# Altium schematic sheet 01.SchDoc
size 420 x 297 mm
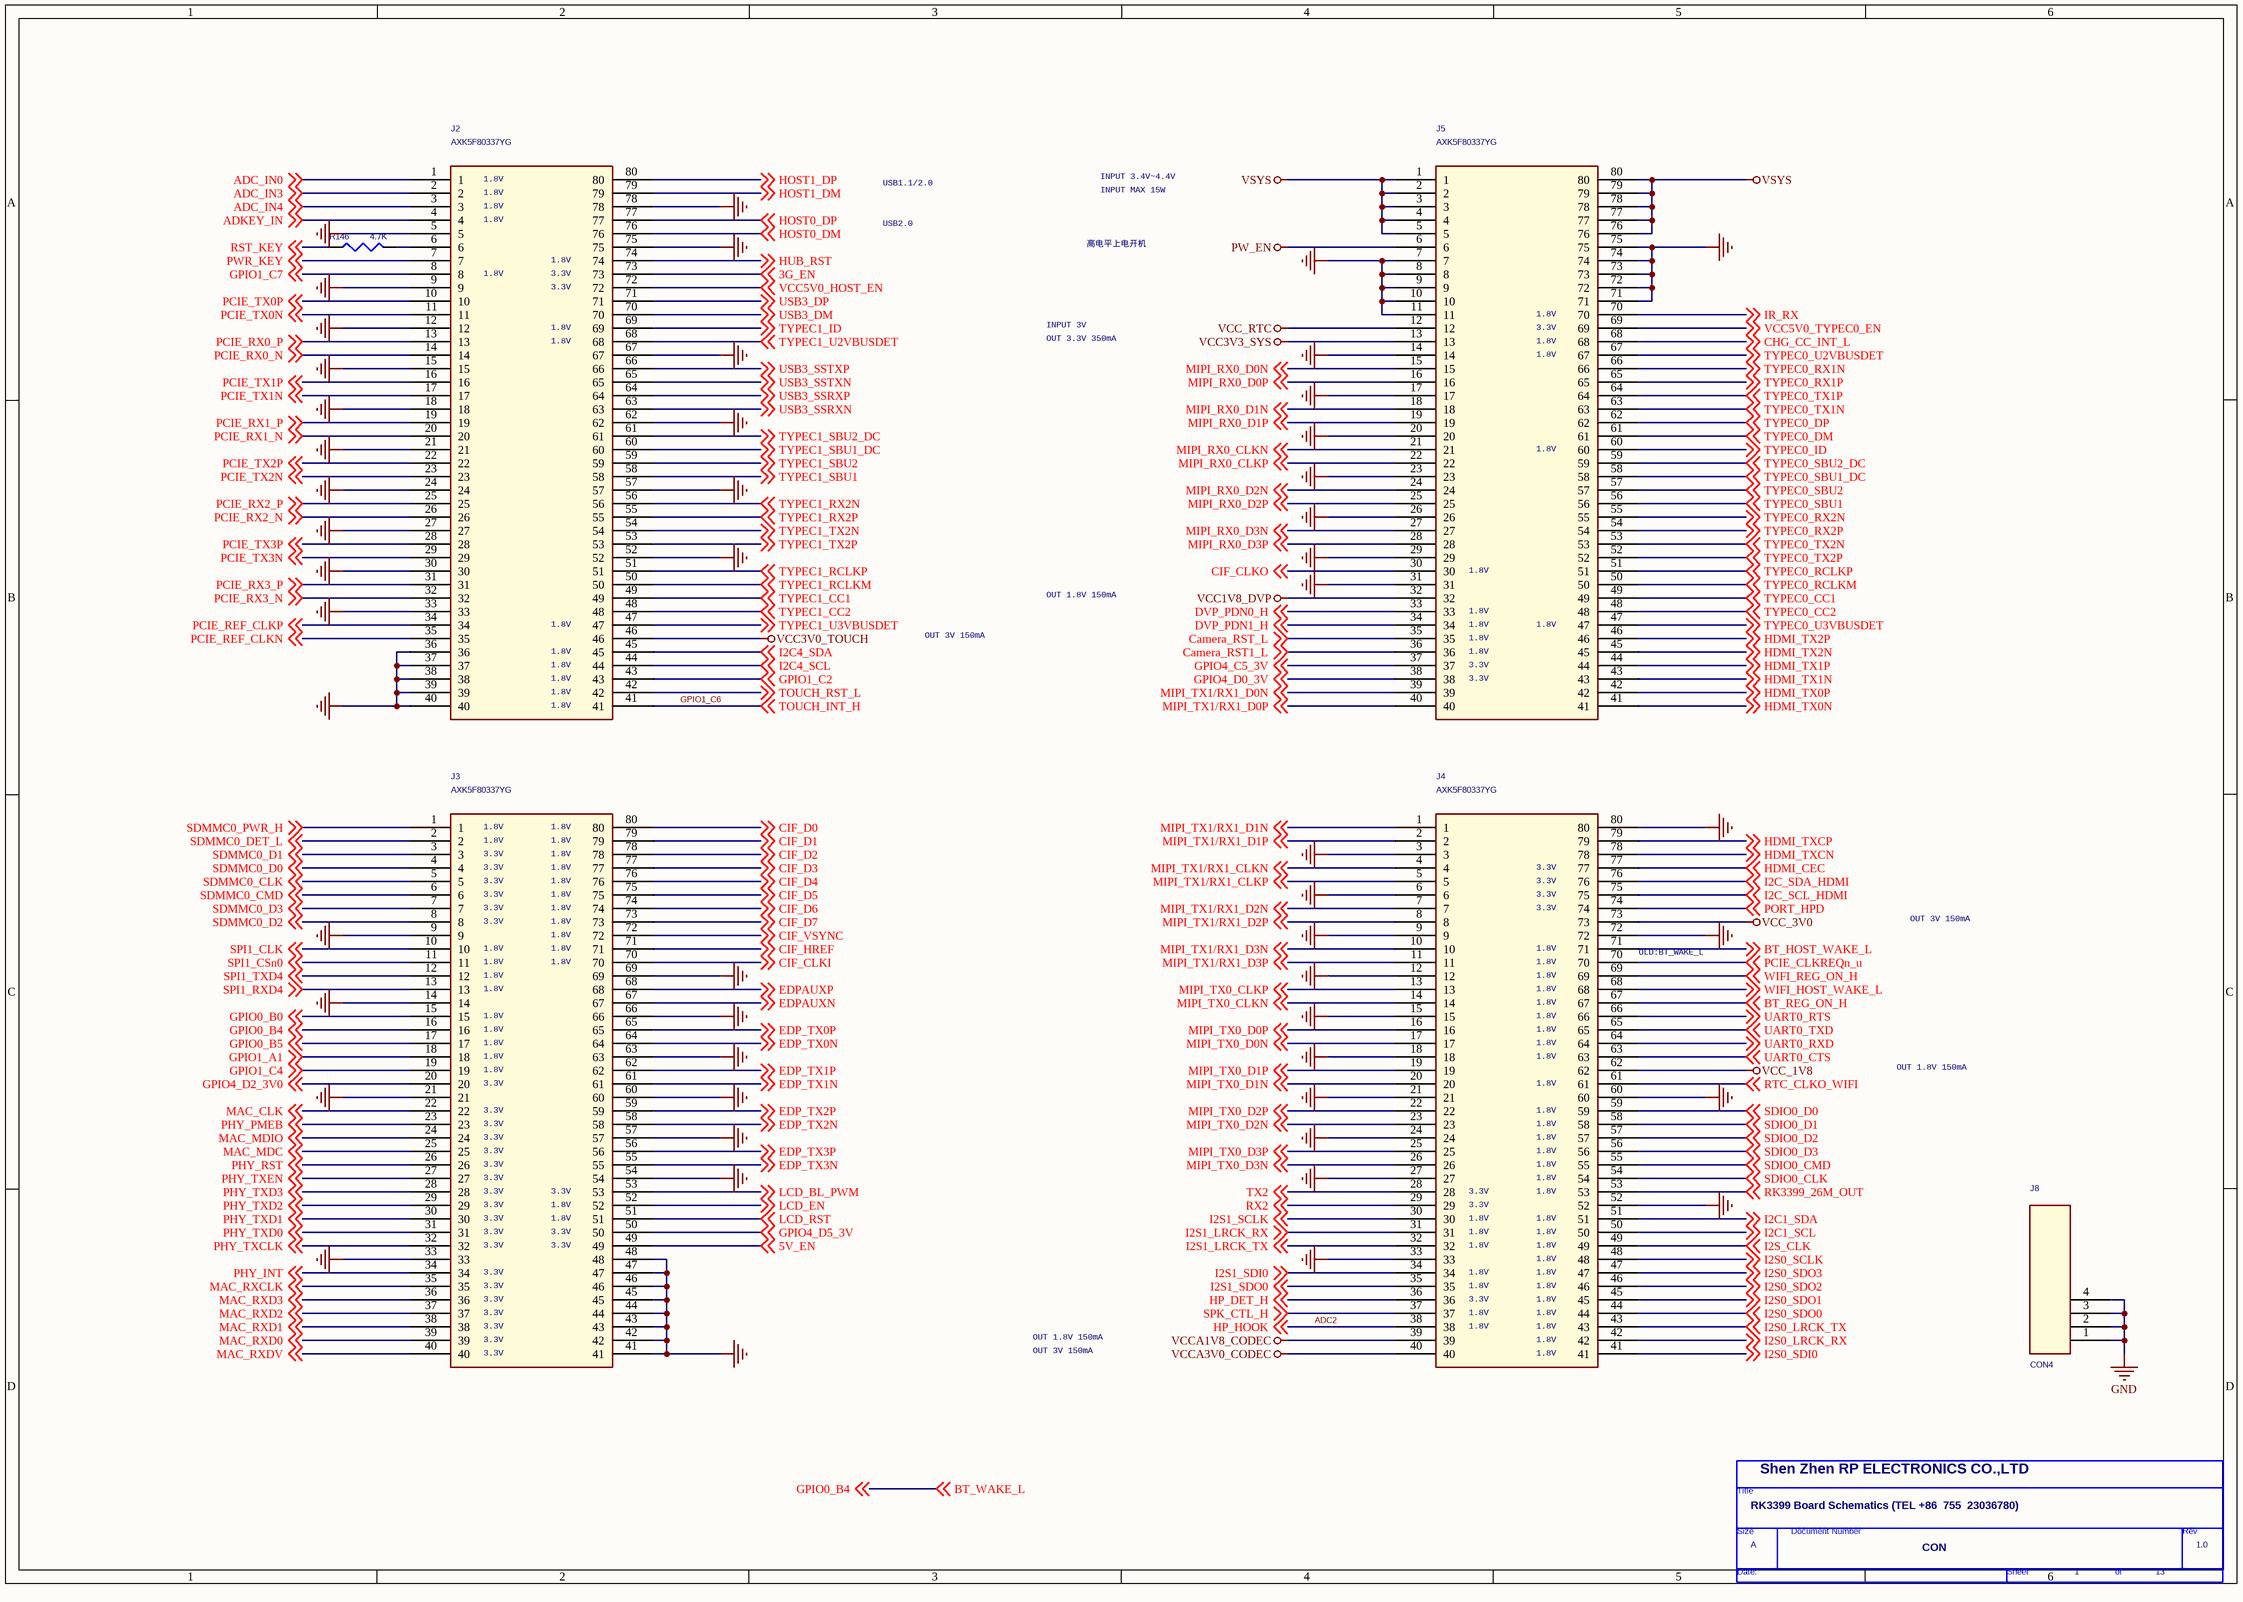
[diagram p0: 01.SchDoc]

## Parts
*  Doc: CON  RevCode: 1.0  Title: RK3399 Board Schematics (TEL +86  755  23036780)  Page Size: A  Page Number: 1  Page Count: 13  Cage Code: Shen Zhen RP ELECTRONICS CO.,LTD  (hidden comment: TitleBlock0)  (graphical)
J2  AXK5F80337YG  [AXK5F80337YG]
J3  AXK5F80337YG  [AXK5F80337YG]
J4  AXK5F80337YG  [AXK5F80337YG]
J5  AXK5F80337YG  [AXK5F80337YG]
J8  CON4  [DIP-CORE]
R146  4.7K  [0805]

## Nets
GND: J2.5 J2.9 J2.12 J2.15 J2.18 J2.21 J2.24 J2.27 J2.30 J2.33 J2.36 J2.37 J2.38 J2.39 J2.40 J2.52 J2.57 J2.62 J2.67 J2.75 J2.78 J3.9 J3.14 J3.21 J3.33 J3.41 J3.42 J3.43 J3.44 J3.45 J3.46 J3.47 J3.48 J3.54 J3.57 J3.60 J3.63 J3.66 J3.69 J4.3 J4.6 J4.9 J4.12 J4.15 J4.18 J4.21 J4.24 J4.27 J4.33 J4.52 J4.60 J4.72 J4.80 J5.7 J5.8 J5.9 J5.10 J5.11 J5.14 J5.17 J5.20 J5.23 J5.26 J5.29 J5.31 J5.71 J5.72 J5.73 J5.74 J5.75 J8.1 J8.2 J8.3 J8.4
PW_EN: J5.6
VCC1V8_DVP: J5.32
VCC3V0_TOUCH: J2.46
VCC3V3_SYS: J5.13
VCC_1V8: J4.62
VCC_3V0: J4.73
VCC_RTC: J5.12
VCCA1V8_CODEC: J4.39
VCCA3V0_CODEC: J4.40
VSYS: J5.1 J5.2 J5.3 J5.4 J5.5 J5.76 J5.77 J5.78 J5.79 J5.80
3G_EN: J2.73 ; off-sheet 3G_EN
5V_EN: J3.49 ; off-sheet 5V_EN
ADC2: J4.38 ; off-sheet HP_HOOK  [also labelled HP_HOOK]
ADC_IN0: J2.1 ; off-sheet ADC_IN0
ADC_IN3: J2.2 ; off-sheet ADC_IN3
ADC_IN4: J2.3 ; off-sheet ADC_IN4
ADKEY_IN: J2.4 ; off-sheet ADKEY_IN
BT_HOST_WAKE_L: J4.71 ; off-sheet BT_HOST_WAKE_L
BT_REG_ON_H: J4.67 ; off-sheet BT_REG_ON_H
BT_WAKE_L: J3.16 ; off-sheet GPIO0_B4, off-sheet BT_WAKE_L  [also labelled GPIO0_B4]
Camera_RST1_L: J5.36 ; off-sheet Camera_RST1_L
Camera_RST_L: J5.35 ; off-sheet Camera_RST_L
CHG_CC_INT_L: J5.68 ; off-sheet CHG_CC_INT_L
CIF_CLKI: J3.70 ; off-sheet CIF_CLKI
CIF_CLKO: J5.30 ; off-sheet CIF_CLKO
CIF_D0: J3.80 ; off-sheet CIF_D0
CIF_D1: J3.79 ; off-sheet CIF_D1
CIF_D2: J3.78 ; off-sheet CIF_D2
CIF_D3: J3.77 ; off-sheet CIF_D3
CIF_D4: J3.76 ; off-sheet CIF_D4
CIF_D5: J3.75 ; off-sheet CIF_D5
CIF_D6: J3.74 ; off-sheet CIF_D6
CIF_D7: J3.73 ; off-sheet CIF_D7
CIF_HREF: J3.71 ; off-sheet CIF_HREF
CIF_VSYNC: J3.72 ; off-sheet CIF_VSYNC
DVP_PDN0_H: J5.33 ; off-sheet DVP_PDN0_H
DVP_PDN1_H: J5.34 ; off-sheet DVP_PDN1_H
EDP_TX0N: J3.64 ; off-sheet EDP_TX0N
EDP_TX0P: J3.65 ; off-sheet EDP_TX0P
EDP_TX1N: J3.61 ; off-sheet EDP_TX1N
EDP_TX1P: J3.62 ; off-sheet EDP_TX1P
EDP_TX2N: J3.58 ; off-sheet EDP_TX2N
EDP_TX2P: J3.59 ; off-sheet EDP_TX2P
EDP_TX3N: J3.55 ; off-sheet EDP_TX3N
EDP_TX3P: J3.56 ; off-sheet EDP_TX3P
EDPAUXN: J3.67 ; off-sheet EDPAUXN
EDPAUXP: J3.68 ; off-sheet EDPAUXP
GPIO0_B0: J3.15 ; off-sheet GPIO0_B0
GPIO0_B5: J3.17 ; off-sheet GPIO0_B5
GPIO1_A1: J3.18 ; off-sheet GPIO1_A1
GPIO1_C2: J2.43 ; off-sheet GPIO1_C2
GPIO1_C4: J3.19 ; off-sheet GPIO1_C4
GPIO1_C6: J2.41 ; off-sheet TOUCH_INT_H  [also labelled TOUCH_INT_H]
GPIO1_C7: J2.8 ; off-sheet GPIO1_C7
GPIO4_C5_3V: J5.37 ; off-sheet GPIO4_C5_3V
GPIO4_D0_3V: J5.38 ; off-sheet GPIO4_D0_3V
GPIO4_D2_3V0: J3.20 ; off-sheet GPIO4_D2_3V0
GPIO4_D5_3V: J3.50 ; off-sheet GPIO4_D5_3V
HDMI_CEC: J4.77 ; off-sheet HDMI_CEC
HDMI_TX0N: J5.41 ; off-sheet HDMI_TX0N
HDMI_TX0P: J5.42 ; off-sheet HDMI_TX0P
HDMI_TX1N: J5.43 ; off-sheet HDMI_TX1N
HDMI_TX1P: J5.44 ; off-sheet HDMI_TX1P
HDMI_TX2N: J5.45 ; off-sheet HDMI_TX2N
HDMI_TX2P: J5.46 ; off-sheet HDMI_TX2P
HDMI_TXCN: J4.78 ; off-sheet HDMI_TXCN
HDMI_TXCP: J4.79 ; off-sheet HDMI_TXCP
HOST0_DM: J2.76 ; off-sheet HOST0_DM
HOST0_DP: J2.77 ; off-sheet HOST0_DP
HOST1_DM: J2.79 ; off-sheet HOST1_DM
HOST1_DP: J2.80 ; off-sheet HOST1_DP
HP_DET_H: J4.36 ; off-sheet HP_DET_H
HUB_RST: J2.74 ; off-sheet HUB_RST
I2C1_SCL: J4.50 ; off-sheet I2C1_SCL
I2C1_SDA: J4.51 ; off-sheet I2C1_SDA
I2C4_SCL: J2.44 ; off-sheet I2C4_SCL
I2C4_SDA: J2.45 ; off-sheet I2C4_SDA
I2C_SCL_HDMI: J4.75 ; off-sheet I2C_SCL_HDMI
I2C_SDA_HDMI: J4.76 ; off-sheet I2C_SDA_HDMI
I2S0_LRCK_RX: J4.42 ; off-sheet I2S0_LRCK_RX
I2S0_LRCK_TX: J4.43 ; off-sheet I2S0_LRCK_TX
I2S0_SCLK: J4.48 ; off-sheet I2S0_SCLK
I2S0_SDI0: J4.41 ; off-sheet I2S0_SDI0
I2S0_SDO0: J4.44 ; off-sheet I2S0_SDO0
I2S0_SDO1: J4.45 ; off-sheet I2S0_SDO1
I2S0_SDO2: J4.46 ; off-sheet I2S0_SDO2
I2S0_SDO3: J4.47 ; off-sheet I2S0_SDO3
I2S1_LRCK_RX: J4.31 ; off-sheet I2S1_LRCK_RX
I2S1_LRCK_TX: J4.32 ; off-sheet I2S1_LRCK_TX
I2S1_SCLK: J4.30 ; off-sheet I2S1_SCLK
I2S1_SDI0: J4.34 ; off-sheet I2S1_SDI0
I2S1_SDO0: J4.35 ; off-sheet I2S1_SDO0
I2S_CLK: J4.49 ; off-sheet I2S_CLK
IR_RX: J5.70 ; off-sheet IR_RX
LCD_BL_PWM: J3.53 ; off-sheet LCD_BL_PWM
LCD_EN: J3.52 ; off-sheet LCD_EN
LCD_RST: J3.51 ; off-sheet LCD_RST
MAC_CLK: J3.22 ; off-sheet MAC_CLK
MAC_MDC: J3.25 ; off-sheet MAC_MDC
MAC_MDIO: J3.24 ; off-sheet MAC_MDIO
MAC_RXCLK: J3.35 ; off-sheet MAC_RXCLK
MAC_RXD0: J3.39 ; off-sheet MAC_RXD0
MAC_RXD1: J3.38 ; off-sheet MAC_RXD1
MAC_RXD2: J3.37 ; off-sheet MAC_RXD2
MAC_RXD3: J3.36 ; off-sheet MAC_RXD3
MAC_RXDV: J3.40 ; off-sheet MAC_RXDV
MIPI_RX0_CLKN: J5.21 ; off-sheet MIPI_RX0_CLKN
MIPI_RX0_CLKP: J5.22 ; off-sheet MIPI_RX0_CLKP
MIPI_RX0_D0N: J5.15 ; off-sheet MIPI_RX0_D0N
MIPI_RX0_D0P: J5.16 ; off-sheet MIPI_RX0_D0P
MIPI_RX0_D1N: J5.18 ; off-sheet MIPI_RX0_D1N
MIPI_RX0_D1P: J5.19 ; off-sheet MIPI_RX0_D1P
MIPI_RX0_D2N: J5.24 ; off-sheet MIPI_RX0_D2N
MIPI_RX0_D2P: J5.25 ; off-sheet MIPI_RX0_D2P
MIPI_RX0_D3N: J5.27 ; off-sheet MIPI_RX0_D3N
MIPI_RX0_D3P: J5.28 ; off-sheet MIPI_RX0_D3P
MIPI_TX0_CLKN: J4.14 ; off-sheet MIPI_TX0_CLKN
MIPI_TX0_CLKP: J4.13 ; off-sheet MIPI_TX0_CLKP
MIPI_TX0_D0N: J4.17 ; off-sheet MIPI_TX0_D0N
MIPI_TX0_D0P: J4.16 ; off-sheet MIPI_TX0_D0P
MIPI_TX0_D1N: J4.20 ; off-sheet MIPI_TX0_D1N
MIPI_TX0_D1P: J4.19 ; off-sheet MIPI_TX0_D1P
MIPI_TX0_D2N: J4.23 ; off-sheet MIPI_TX0_D2N
MIPI_TX0_D2P: J4.22 ; off-sheet MIPI_TX0_D2P
MIPI_TX0_D3N: J4.26 ; off-sheet MIPI_TX0_D3N
MIPI_TX0_D3P: J4.25 ; off-sheet MIPI_TX0_D3P
MIPI_TX1/RX1_CLKN: J4.4 ; off-sheet MIPI_TX1/RX1_CLKN
MIPI_TX1/RX1_CLKP: J4.5 ; off-sheet MIPI_TX1/RX1_CLKP
MIPI_TX1/RX1_D0N: J5.39 ; off-sheet MIPI_TX1/RX1_D0N
MIPI_TX1/RX1_D0P: J5.40 ; off-sheet MIPI_TX1/RX1_D0P
MIPI_TX1/RX1_D1N: J4.1 ; off-sheet MIPI_TX1/RX1_D1N
MIPI_TX1/RX1_D1P: J4.2 ; off-sheet MIPI_TX1/RX1_D1P
MIPI_TX1/RX1_D2N: J4.7 ; off-sheet MIPI_TX1/RX1_D2N
MIPI_TX1/RX1_D2P: J4.8 ; off-sheet MIPI_TX1/RX1_D2P
MIPI_TX1/RX1_D3N: J4.10 ; off-sheet MIPI_TX1/RX1_D3N
MIPI_TX1/RX1_D3P: J4.11 ; off-sheet MIPI_TX1/RX1_D3P
PCIE_CLKREQn_u: J4.70 ; off-sheet PCIE_CLKREQn_u
PCIE_REF_CLKN: J2.35 ; off-sheet PCIE_REF_CLKN
PCIE_REF_CLKP: J2.34 ; off-sheet PCIE_REF_CLKP
PCIE_RX0_N: J2.14 ; off-sheet PCIE_RX0_N
PCIE_RX0_P: J2.13 ; off-sheet PCIE_RX0_P
PCIE_RX1_N: J2.20 ; off-sheet PCIE_RX1_N
PCIE_RX1_P: J2.19 ; off-sheet PCIE_RX1_P
PCIE_RX2_N: J2.26 ; off-sheet PCIE_RX2_N
PCIE_RX2_P: J2.25 ; off-sheet PCIE_RX2_P
PCIE_RX3_N: J2.32 ; off-sheet PCIE_RX3_N
PCIE_RX3_P: J2.31 ; off-sheet PCIE_RX3_P
PCIE_TX0N: J2.11 ; off-sheet PCIE_TX0N
PCIE_TX0P: J2.10 ; off-sheet PCIE_TX0P
PCIE_TX1N: J2.17 ; off-sheet PCIE_TX1N
PCIE_TX1P: J2.16 ; off-sheet PCIE_TX1P
PCIE_TX2N: J2.23 ; off-sheet PCIE_TX2N
PCIE_TX2P: J2.22 ; off-sheet PCIE_TX2P
PCIE_TX3N: J2.29 ; off-sheet PCIE_TX3N
PCIE_TX3P: J2.28 ; off-sheet PCIE_TX3P
PHY_INT: J3.34 ; off-sheet PHY_INT
PHY_PMEB: J3.23 ; off-sheet PHY_PMEB
PHY_RST: J3.26 ; off-sheet PHY_RST
PHY_TXCLK: J3.32 ; off-sheet PHY_TXCLK
PHY_TXD0: J3.31 ; off-sheet PHY_TXD0
PHY_TXD1: J3.30 ; off-sheet PHY_TXD1
PHY_TXD2: J3.29 ; off-sheet PHY_TXD2
PHY_TXD3: J3.28 ; off-sheet PHY_TXD3
PHY_TXEN: J3.27 ; off-sheet PHY_TXEN
PORT_HPD: J4.74 ; off-sheet PORT_HPD
PWR_KEY: J2.7 ; off-sheet PWR_KEY
RK3399_26M_OUT: J4.53 ; off-sheet RK3399_26M_OUT
RST_KEY: R146.1 ; off-sheet RST_KEY
RTC_CLKO_WIFI: J4.61 ; off-sheet RTC_CLKO_WIFI
RX2: J4.29 ; off-sheet RX2
SDIO0_CLK: J4.54 ; off-sheet SDIO0_CLK
SDIO0_CMD: J4.55 ; off-sheet SDIO0_CMD
SDIO0_D0: J4.59 ; off-sheet SDIO0_D0
SDIO0_D1: J4.58 ; off-sheet SDIO0_D1
SDIO0_D2: J4.57 ; off-sheet SDIO0_D2
SDIO0_D3: J4.56 ; off-sheet SDIO0_D3
SDMMC0_CLK: J3.5 ; off-sheet SDMMC0_CLK
SDMMC0_CMD: J3.6 ; off-sheet SDMMC0_CMD
SDMMC0_D0: J3.4 ; off-sheet SDMMC0_D0
SDMMC0_D1: J3.3 ; off-sheet SDMMC0_D1
SDMMC0_D2: J3.8 ; off-sheet SDMMC0_D2
SDMMC0_D3: J3.7 ; off-sheet SDMMC0_D3
SDMMC0_DET_L: J3.2 ; off-sheet SDMMC0_DET_L
SDMMC0_PWR_H: J3.1 ; off-sheet SDMMC0_PWR_H
SPI1_CLK: J3.10 ; off-sheet SPI1_CLK
SPI1_CSn0: J3.11 ; off-sheet SPI1_CSn0
SPI1_RXD4: J3.13 ; off-sheet SPI1_RXD4
SPI1_TXD4: J3.12 ; off-sheet SPI1_TXD4
SPK_CTL_H: J4.37 ; off-sheet SPK_CTL_H
TOUCH_RST_L: J2.42 ; off-sheet TOUCH_RST_L
TX2: J4.28 ; off-sheet TX2
TYPEC0_CC1: J5.49 ; off-sheet TYPEC0_CC1
TYPEC0_CC2: J5.48 ; off-sheet TYPEC0_CC2
TYPEC0_DM: J5.61 ; off-sheet TYPEC0_DM
TYPEC0_DP: J5.62 ; off-sheet TYPEC0_DP
TYPEC0_ID: J5.60 ; off-sheet TYPEC0_ID
TYPEC0_RCLKM: J5.50 ; off-sheet TYPEC0_RCLKM
TYPEC0_RCLKP: J5.51 ; off-sheet TYPEC0_RCLKP
TYPEC0_RX1N: J5.66 ; off-sheet TYPEC0_RX1N
TYPEC0_RX1P: J5.65 ; off-sheet TYPEC0_RX1P
TYPEC0_RX2N: J5.55 ; off-sheet TYPEC0_RX2N
TYPEC0_RX2P: J5.54 ; off-sheet TYPEC0_RX2P
TYPEC0_SBU1: J5.56 ; off-sheet TYPEC0_SBU1
TYPEC0_SBU1_DC: J5.58 ; off-sheet TYPEC0_SBU1_DC
TYPEC0_SBU2: J5.57 ; off-sheet TYPEC0_SBU2
TYPEC0_SBU2_DC: J5.59 ; off-sheet TYPEC0_SBU2_DC
TYPEC0_TX1N: J5.63 ; off-sheet TYPEC0_TX1N
TYPEC0_TX1P: J5.64 ; off-sheet TYPEC0_TX1P
TYPEC0_TX2N: J5.53 ; off-sheet TYPEC0_TX2N
TYPEC0_TX2P: J5.52 ; off-sheet TYPEC0_TX2P
TYPEC0_U2VBUSDET: J5.67 ; off-sheet TYPEC0_U2VBUSDET
TYPEC0_U3VBUSDET: J5.47 ; off-sheet TYPEC0_U3VBUSDET
TYPEC1_CC1: J2.49 ; off-sheet TYPEC1_CC1
TYPEC1_CC2: J2.48 ; off-sheet TYPEC1_CC2
TYPEC1_ID: J2.69 ; off-sheet TYPEC1_ID
TYPEC1_RCLKM: J2.50 ; off-sheet TYPEC1_RCLKM
TYPEC1_RCLKP: J2.51 ; off-sheet TYPEC1_RCLKP
TYPEC1_RX2N: J2.56 ; off-sheet TYPEC1_RX2N
TYPEC1_RX2P: J2.55 ; off-sheet TYPEC1_RX2P
TYPEC1_SBU1: J2.58 ; off-sheet TYPEC1_SBU1
TYPEC1_SBU1_DC: J2.60 ; off-sheet TYPEC1_SBU1_DC
TYPEC1_SBU2: J2.59 ; off-sheet TYPEC1_SBU2
TYPEC1_SBU2_DC: J2.61 ; off-sheet TYPEC1_SBU2_DC
TYPEC1_TX2N: J2.54 ; off-sheet TYPEC1_TX2N
TYPEC1_TX2P: J2.53 ; off-sheet TYPEC1_TX2P
TYPEC1_U2VBUSDET: J2.68 ; off-sheet TYPEC1_U2VBUSDET
TYPEC1_U3VBUSDET: J2.47 ; off-sheet TYPEC1_U3VBUSDET
UART0_CTS: J4.63 ; off-sheet UART0_CTS
UART0_RTS: J4.66 ; off-sheet UART0_RTS
UART0_RXD: J4.64 ; off-sheet UART0_RXD
UART0_TXD: J4.65 ; off-sheet UART0_TXD
USB3_DM: J2.70 ; off-sheet USB3_DM
USB3_DP: J2.71 ; off-sheet USB3_DP
USB3_SSRXN: J2.63 ; off-sheet USB3_SSRXN
USB3_SSRXP: J2.64 ; off-sheet USB3_SSRXP
USB3_SSTXN: J2.65 ; off-sheet USB3_SSTXN
USB3_SSTXP: J2.66 ; off-sheet USB3_SSTXP
VCC5V0_HOST_EN: J2.72 ; off-sheet VCC5V0_HOST_EN
VCC5V0_TYPEC0_EN: J5.69 ; off-sheet VCC5V0_TYPEC0_EN
WIFI_HOST_WAKE_L: J4.68 ; off-sheet WIFI_HOST_WAKE_L
WIFI_REG_ON_H: J4.69 ; off-sheet WIFI_REG_ON_H
NetJ2_6: J2.6 R146.2

## Notes on the sheet
- (near J2) 1.8V
- USB1.1/2.0
- INPUT MAX 15W
- INPUT 3.4V~4.4V
- USB2.0
- 高电平上电开机
- (near J2) 3.3V
- INPUT 3V
- (near J5) 1.8V
- (near J5) 3.3V
- OUT 3.3V 350mA
- OUT 1.8V 150mA
- OUT 3V 150mA
- (near J3) 1.8V
- (near J3) 3.3V
- (near J4) 3.3V
- (near J4) 1.8V
- (near J4) OLD:BT_WAKE_L
- (in symbol TitleBlock0) Title; Size; Document Number; Rev; Date:; Sheet; of

## Library data of the parts
J2-J5 = CON40_0
J8 = CON10_0
R146 = R_Dup1
* = TitleBlock0: Page Create Date: March  8, 1995